# Altium schematic sheet Water_SmartSchematicV1.SchDoc
size A; SheetNumber: 1; SheetTotal: 2
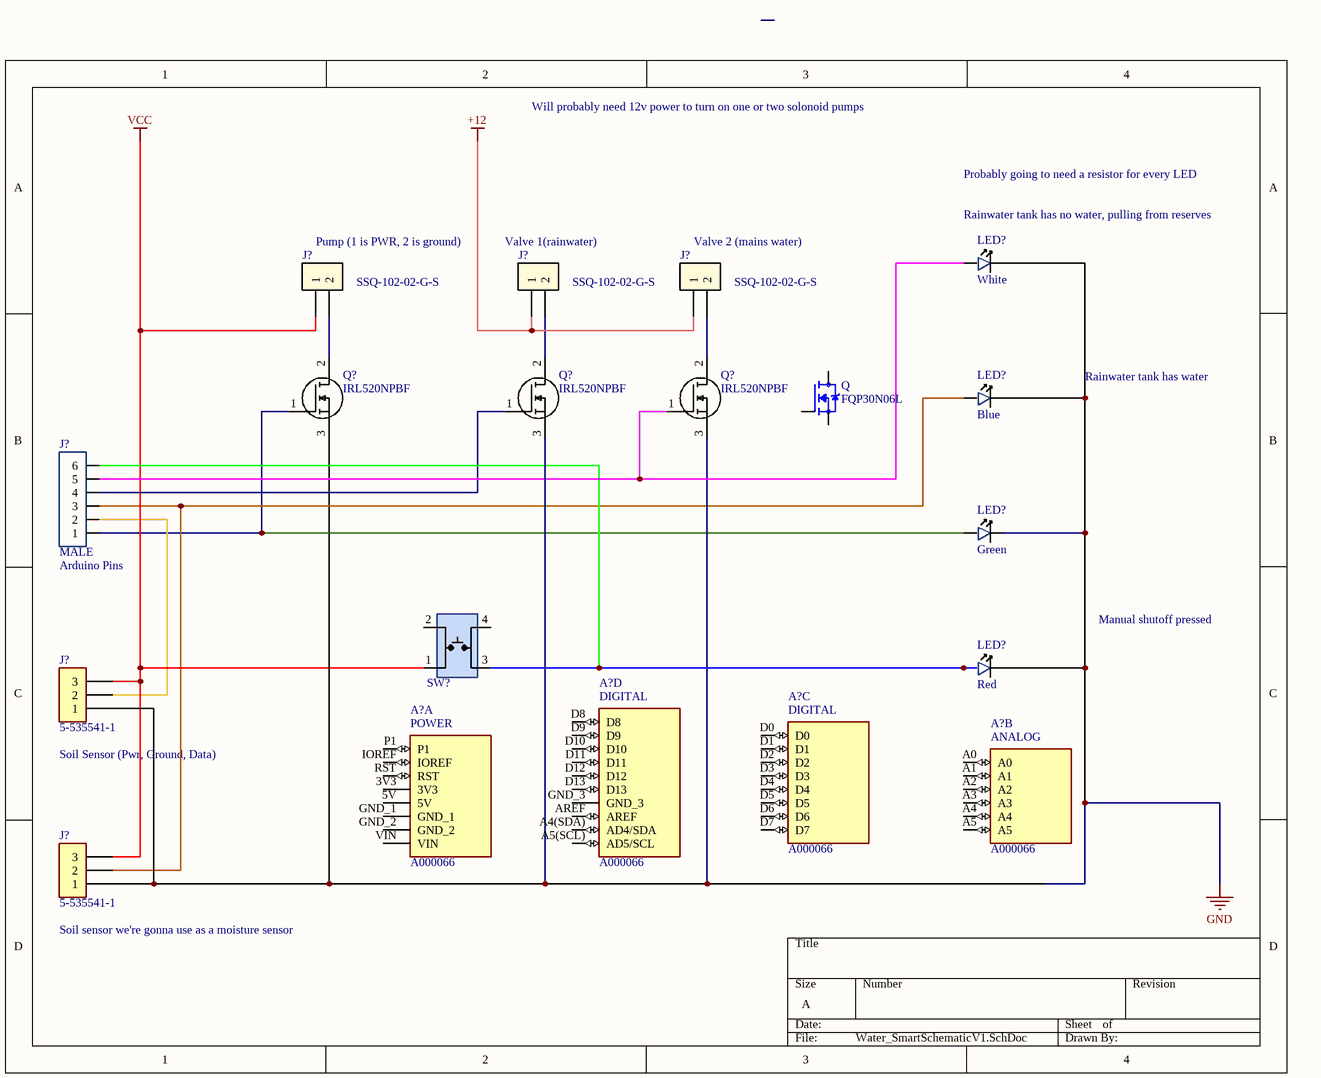
[diagram p0: Water_SmartSchematicV1.SchDoc]

## Parts
(Parts that share a designator on the sheet are numbered #1, #2 ... from top to bottom, then left to right.)
A?#1  A000066  [ARDUINO_A000066]  (part D of 4)
A?#2  A000066  [ARDUINO_A000066]  (part C of 4)
A?#3  A000066  [ARDUINO_A000066]  (part B of 4)
A?#4  A000066  [ARDUINO_A000066]  (part A of 4)
J?#1  SSQ-102-02-G-S  [JF-2_1X2_TU_SSQ]
J?#2  SSQ-102-02-G-S  [JF-2_1X2_TU_SSQ]
J?#3  SSQ-102-02-G-S  [JF-2_1X2_TU_SSQ]
J?#4  MALE  [6_PIN_100MIL-Male]
J?#5  5-535541-1  [JF_TE_5-535541-1]
J?#6  5-535541-1  [JF_TE_5-535541-1]
LED?#1  White  [LED_1206]
LED?#2  Blue  [LED_1206]
LED?#3  Green  [LED_1206]
LED?#4  Red  [LED_1206]
Q  FQP30N06L  [TO220V]
Q?#1  IRL520NPBF  [TO254P469X1042X1967-3P]
Q?#2  IRL520NPBF  [TO254P469X1042X1967-3P]
Q?#3  IRL520NPBF  [TO254P469X1042X1967-3P]
SW?  TL3305AF160QG  [Switch_JLC]  (value not drawn)

## Nets
+12: J?#2.1 J?#3.1
GND: J?#5.1 J?#6.1 LED?#1.2 LED?#2.2 LED?#3.2 LED?#4.2 Q?#1.3(S) Q?#2.3(S) Q?#3.3(S)
VCC: J?#1.1 J?#5.3 J?#6.3 SW?.1
NetJ?#1_2: J?#1.2 Q?#1.2(D)
NetJ?#2_2: J?#2.2 Q?#2.2(D)
NetJ?#3_2: J?#3.2 Q?#3.2(D)
NetJ?#4_1: J?#4.1 LED?#3.1 Q?#1.1(G)
NetJ?#4_2: J?#4.2 J?#5.2
NetJ?#4_3: J?#4.3 J?#6.2 LED?#2.1
NetJ?#4_4: J?#4.4 Q?#2.1(G)
NetJ?#4_5: J?#4.5 LED?#1.1 Q?#3.1(G)
NetJ?#4_6: J?#4.6 LED?#4.1 SW?.3

Not connected (* = marked no-connect by the designer): A?#1 A4(SDA)(AD4/SDA) A5(SCL)(AD5/SCL) AREF D8 D9 D10 D11 D12 D13 GND_3; A?#2 D0 D1 D2 D3 D4 D5 D6 D7; A?#3 A0 A1 A2 A3 A4 A5; A?#4 3V3 5V GND_1 GND_2 IOREF P1 RST VIN; Q 1(G) 2(D) 3(S); SW? 2 4

## Notes on the sheet
- Will probably need 12v power to turn on one or two solonoid pumps
- Probably going to need a resistor for every LED
- (near LED?#1) Rainwater tank has no water, pulling from reserves
- (near J?#1) Pump (1 is PWR, 2 is ground)
- (near J?#2) Valve 1(rainwater)
- (near J?#3) Valve 2 (mains water)
- Rainwater tank has water
- (near J?#4) Arduino Pins
- Manual shutoff pressed
- (near J?#5) Soil Sensor (Pwr, Ground, Data)
- (near J?#6) Soil sensor we're gonna use as a moisture sensor
- (in symbol A000066, part A) POWER
- (in symbol A000066, part B) ANALOG
- (in symbol A000066, part C) DIGITAL
- (in symbol A000066, part D) DIGITAL

## Library data of the parts
A?#1-A?#4 = A000066: Microcontroller board based on the ATmega328P.; pin to pad: A4(SDA)>A4(SDA; MF: Arduino; MP: Arduino Uno Rev3; Value: *; SnapEDA_Link: https://www.snapeda.com/parts/Arduino%20Uno%20Rev3/Arduino/view-part/?ref=snap; Availability: Not in stock; Price: None; Package: Non-Standard Arduino; Check_prices: https://www.snapeda.com/parts/Arduino%20Uno%20Rev3/Arduino/view-part/?ref=eda
J?#1-J?#3 = JF_2_PIN_FEMALE: 2.54mm Straight 1x2P 2 1 Straight,P=2.54mm  Female Headers ROHSon Available; MFR PART #: C49661; MFR PN: SSQ-102-02-G-S; LCSC PART#: C49661
J?#4 = JM_6_PIN_MALE: Male header- 6 pin 1 row- through Hole; LCSC Part#: C37208; Datasheet: https://datasheet.lcsc.com/szlcsc/1810312320_BOOMELE-Boom-Precision-Elec-C37208_C37208.pdf; Type: Extended; Value: MALE
J?#5 J?#6 = JF_3_PIN_FEMALE: Conn Socket Strip RCP 3 POS 2.54mm Solder ST Thru-Hole; MFR PART #: PM2.54-1*3; MP: 5-535541-1; LCSC PART#: C5116529
LED?#1 = LED_WHITE_1206: White light 1206  Light Emitting Diodes (LED) ROHS; MFR Part #: NCD1206W1; Type: Extended; LCSC Part#: C130718; Datasheet: https://datasheet.lcsc.com/lcsc/2008201033_Foshan-NationStar-Optoelectronics-NCD1206W1_C130718.pdf; Value: White
LED?#2 = LED_BLUE_1206: blue 1206  Light Emitting Diodes (LED) ROHS; MFR Part #: NCD1206B1; Type: Extended; LCSC Part#: C130717; Datasheet: https://datasheet.lcsc.com/lcsc/2008201033_Foshan-NationStar-Optoelectronics-NCD1206B1_C130717.pdf; Value: Blue
LED?#3 = LED_GREEN_1206: Green 513~528nm 1206 Light Emitting Diodes (LED) RoHS; MFR Part #: SZYY1206G; Type: Extended; LCSC Part#: C434439; Datasheet: https://datasheet.lcsc.com/lcsc/2006301532_Yongyu-Photoelectric-SZYY1206G_C434439.pdf; Value: Green
LED?#4 = LED_RED_1206: Red 621~631nm 1206 Light Emitting Diodes (LED) RoHS; MFR Part #: 15-21/R6C-FQ1R1B/2T; Type: Extended; LCSC Part#: C93133; Datasheet: https://datasheet.lcsc.com/szlcsc/1811151241_Everlight-Elec-15-21-R6C-FQ1R1B-2T_C93133.pdf; Value: Red
Q = FQP30N06L: N-Channel 60V 32A _Tc_ 79W _Tc_ Through Hole TO-220-3; MF: ON Semiconductor; Package: TO-220 ON Semiconductor; Price: None; Availability: Unavailable; MP: FQP30N06L; SnapEDA_Link: https://www.snapeda.com/parts/FQP30N06L/ON%20Semiconductor/view-part/1413126/?ref=snap; Value: *
Q?#1-Q?#3 = Q_Nch_MOSFET_PTH: MOSFET (N-Channel)  IRL520NPBF; Manufacturer_Name: Infineon; Datasheet Link: https://www.infineon.com/dgdl/irl520npbf.pdf?fileId=5546d462533600a40153565f9b62255b; Height: 4.69mm; Manufacturer_Part_Number: IRL520NPBF; Mouser Part Number: 942-IRL520NPBF; Mouser Price/Stock: https://www.mouser.co.uk/ProductDetail/Infineon-IR/IRL520NPBF?qs=9%252BKlkBgLFf3eZ5ppEpIaKQ%3D%3D; Arrow Part Number: IRL520NPBF; Arrow Price/Stock: https://www.arrow.com/en/products/irl520npbf/infineon-technologies-ag?region=nac
SW? = SW_Push_Button_JLC: Tactile Switch SPST-NO Top Actuated Surface Mount; MFR Part #: KH-4.5X4.5X4.3H-STM; LCSC Part#: C2837550; Type: Extended; DataSheet: https://datasheet.lcsc.com/lcsc/2106081532_Shenzhen-Kinghelm-Elec-KH-4.5X4.5X4.3H-STM_C2837550.pdf